# EAGLE design PiRingo_04 (EAGLE 6.5.0)
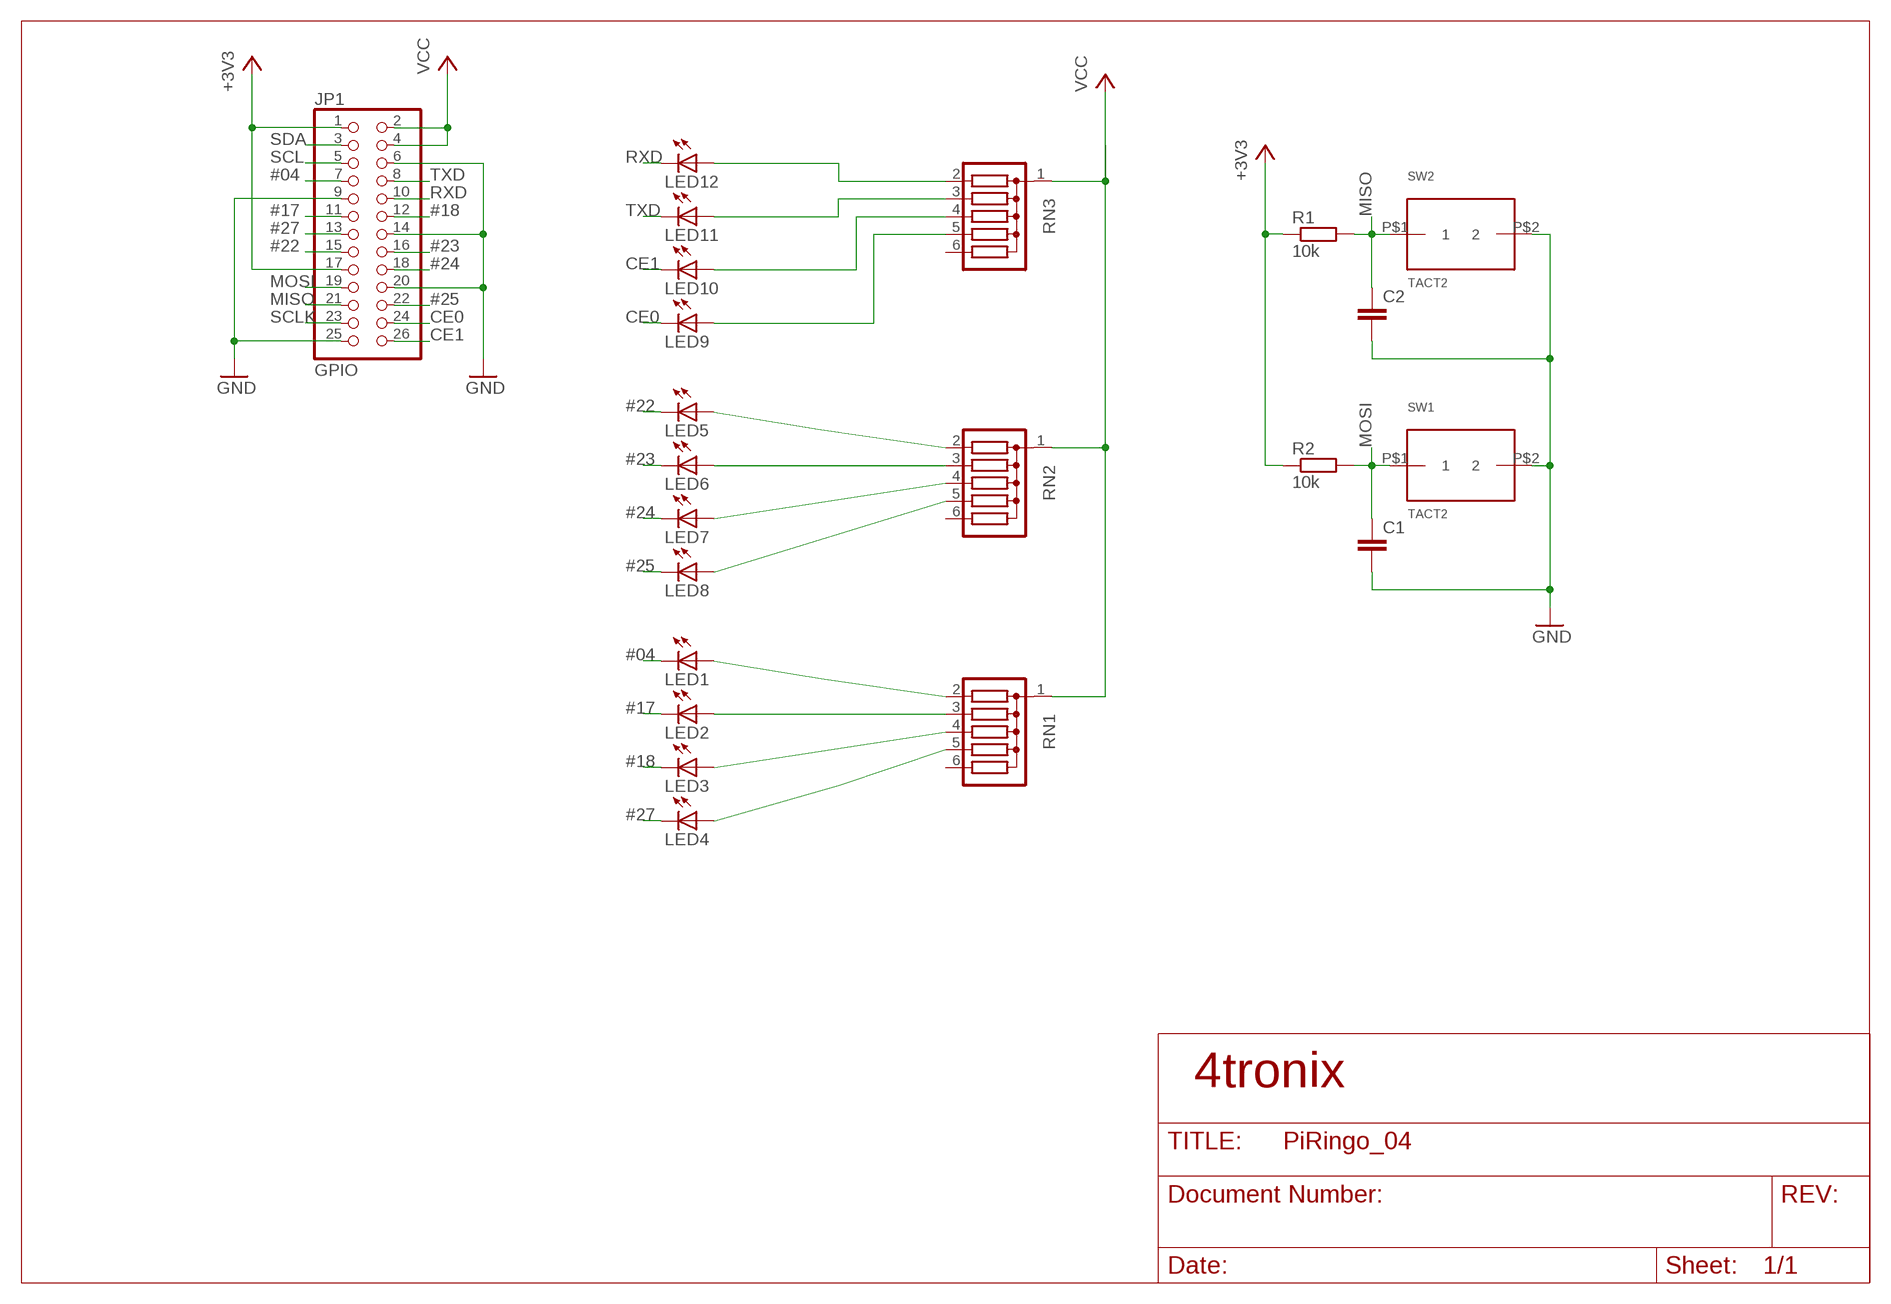
[diagram p0: schematic, sheet 1]

## Parts
C1  C5/2.5  [C5B2.5]
C2  C5/2.5  [C5B2.5]
JP1  GPIO  HEADER-2X13  [2X13]
LED1  LED3MM  [LED3MM]
LED2  LED3MM  [LED3MM]
LED3  LED3MM  [LED3MM]
LED4  LED3MM  [LED3MM]
LED5  LED3MM  [LED3MM]
LED6  LED3MM  [LED3MM]
LED7  LED3MM  [LED3MM]
LED8  LED3MM  [LED3MM]
LED9  LED3MM  [LED3MM]
LED10  LED3MM  [LED3MM]
LED11  LED3MM  [LED3MM]
LED12  LED3MM  [LED3MM]
R1  10k  R-EU_0207/7  [0207/7]
R2  10k  R-EU_0207/7  [0207/7]
RN1  G05R  [SIL6]
RN2  G05R  [SIL6]
RN3  G05R  [SIL6]
SW1  TACT2  [TACT2-PIN]
SW2  TACT2  [TACT2-PIN]

## Nets
#04: JP1.7 LED1.K(C)
#17: JP1.11 LED2.K(C)
#18: JP1.12 LED3.K(C)
#22: JP1.15 LED5.K(C)
#23: JP1.16 LED6.K(C)
#24: JP1.18 LED7.K(C)
#25: JP1.22 LED8.K(C)
#27: JP1.13 LED4.K(C)
+3V3: JP1.1 JP1.17 R1.1 R2.1
CE0: JP1.24 LED9.K(C)
CE1: JP1.26 LED10.K(C)
GND: C1.2 C2.2 JP1.6 JP1.9 JP1.14 JP1.20 JP1.25 SW1.P$2 SW2.P$2
MISO: C2.1 JP1.21 R1.2 SW2.P$1
MOSI: C1.1 JP1.19 R2.2 SW1.P$1
N$1: LED12.A RN3.2
N$2: LED1.A RN1.2
N$3: LED11.A RN3.3
N$4: LED10.A RN3.4
N$6: LED2.A RN1.3
N$7: LED3.A RN1.4
N$8: LED4.A RN1.5
N$9: LED5.A RN2.2
N$10: LED6.A RN2.3
N$11: LED7.A RN2.4
N$12: LED8.A RN2.5
N$13: LED9.A RN3.5
RXD: JP1.10 LED12.K(C)
SCL: JP1.5
SCLK: JP1.23
SDA: JP1.3
TXD: JP1.8 LED11.K(C)
VCC: JP1.2 JP1.4 RN1.1 RN2.1 RN3.1
Unconnected: RN1.6 RN2.6 RN3.6

## Notes on the sheet
- 4tronix

## Library data of the parts
C1 C2 = capacitor-wima:C: CAPACITOR naming: grid - package width
JP1 = microbuilder:HEADER-2X13
LED1-LED12 = adafruit:LED: LED OSRAM: - CHIPLED LG R971, LG N971, LY N971, LG Q971, LY Q971, LO R971, LY R971 LH N974, LH R974 LS Q976, LO Q976, LY Q976 LO Q996 - Hyper CHIPLED LW Q18S LB Q993, LB Q99A, LB R99A - SideLED LS A670, LO A670, LY A670, LG A670, LP A670 LB A673, LV A673, LT A673, LW A673 LH A674 LY A675 LS A676, LA A676, LO A676, LY A676, LW A676 LS A679, LY A679, LG A679 - Hyper Micro SIDELED® LS Y876, LA Y876, LO Y876, LY Y876 LT Y87S - SmartLED LW L88C, LW L88S LB L89C, LB L89S, LG L890 LS L89K, LO L89K, LY L89K LS L896, LA L896, LO L896, LY L896 - TOPLED LS T670, LO T670, LY T670, LG T670, LP T670 LSG T670, LSP T670, LSY T670, LOP T670, LYG T670 LG T671, LOG T671, LSG T671 LB T673, LV T673, LT T673, LW T673 LH T674 LS T676, LA T676, LO T676, LY T676, LB T676, LH T676, LSB T676, LW T676 LB T67C, LV T67C, LT T67C, LS T67K, LO T67K, LY T67K, LW E67C LS E67B, LA E67B, LO E67B, LY E67B, LB E67C, LV E67C, LT E67C LW T67C LS T679, LY T679, LG T679 LS T770, LO T770, LY T770, LG T770, LP T770 LB T773, LV T773, LT T773, LW T773 LH T774 LS E675, LA E675, LY E675, LS T675 LS T776, LA T776, LO T776, LY T776, LB T776 LHGB T686 LT T68C, LB T68C - Hyper Mini TOPLED® LB M676 - Mini TOPLED Santana® LG M470 LS M47K, LO M47K, LY M47K Source: http://www.osram.convergy.de/
R1 R2 = rcl:R-EU_: RESISTOR, European symbol
RN1-RN3 = resistor-sil:G05R: SIL RESISTOR; OC_FARNELL: unknown; OC_NEWARK: unknown
SW1 SW2 = 4tronix:TACT2

## Board
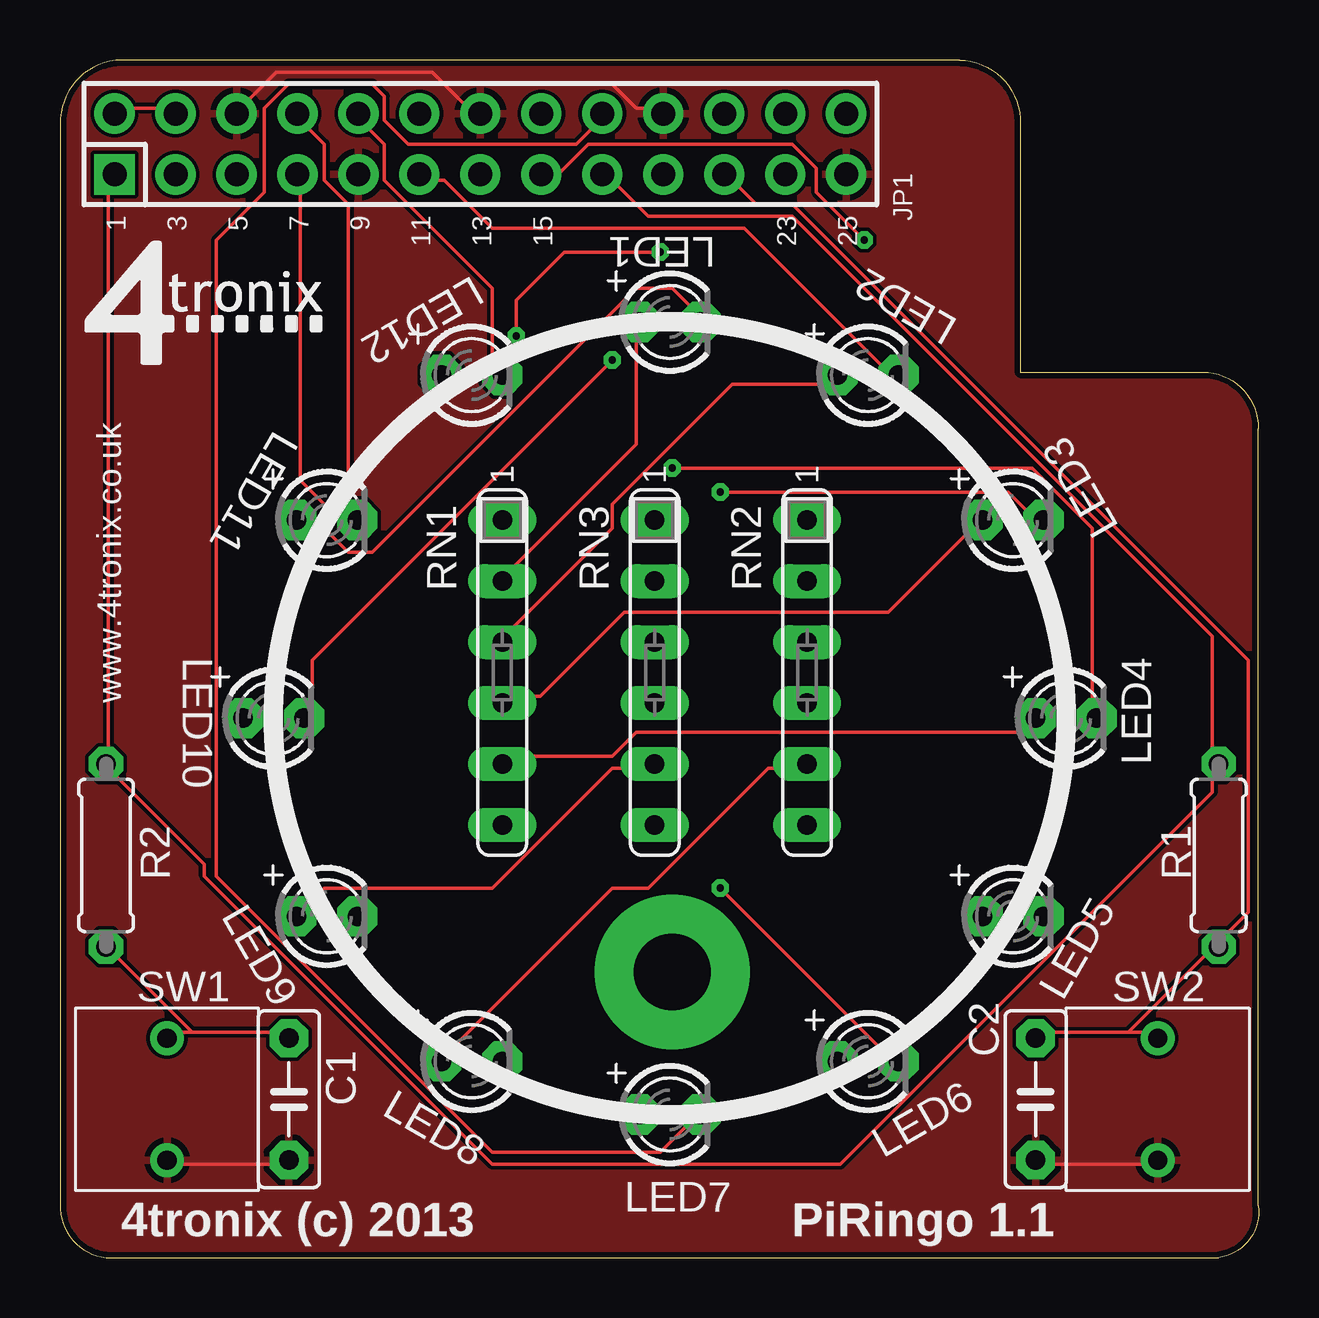
[diagram p1: board, top side]
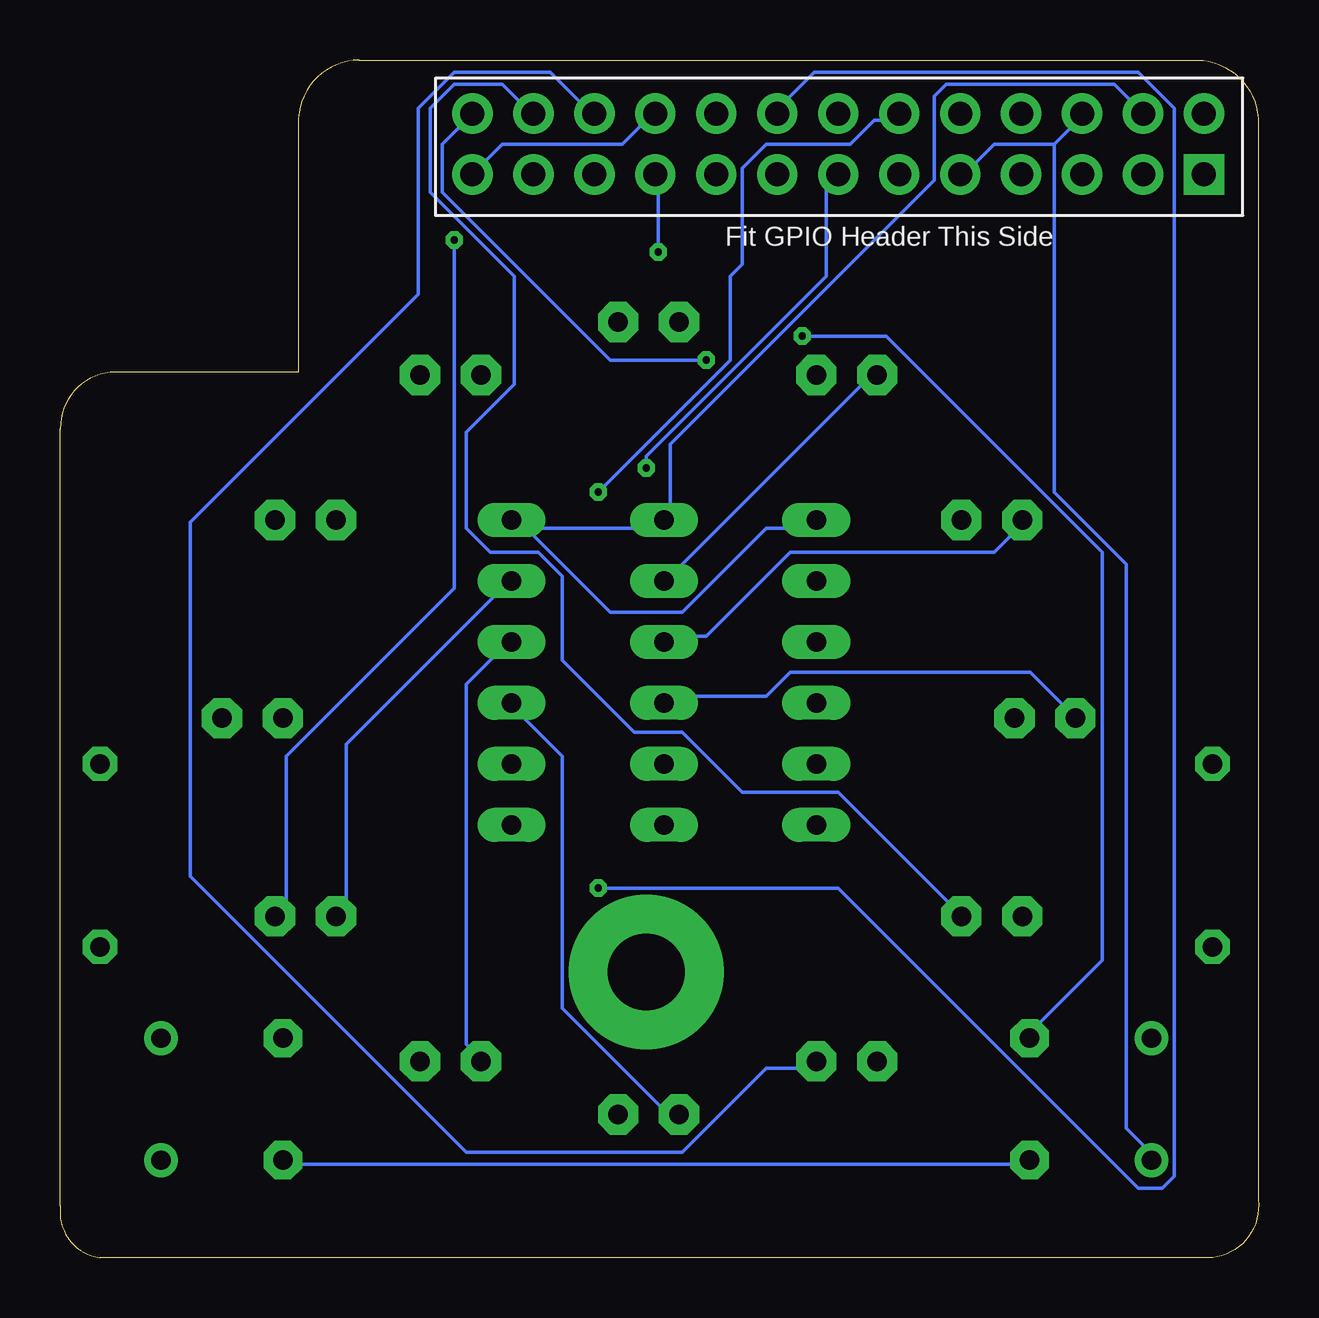
[diagram p2: board, bottom side, seen from below]

Size 49.94 x 49.9 mm. Coordinates in mm from the lower left corner, seen from the top.
Outline: 40.01,47.24 40.01,38.99
Outline: 40.01,47.24 arc90 37.48,49.9 2.55,49.9 arc90 0.01,47.24 0.01,2.41 arc90 1.92,0 48.27,0 arc90 49.93,2.16 49.93,34.54 arc90 47.64,36.9 40.02,36.9 40.02,38.99
Outline: 40.01,47.24 40.02,44.7
Copper layers (1*16): Top 0.035mm / dielectric 1.5mm / Bottom 0.035mm
Design rules "DFRobot_Eagle_Rule_v0.4": minimum track width 6mil, minimum drill 12mil, track to track 6mil, track to pad 6mil, pad to pad 6mil, via to via 6mil, smd to smd 0mil, copper to edge 10mil, drill to drill 10mil, minimum pad ring 12mil, minimum via ring 8mil, stop-mask expansion 2mil, vias tented up to drill 25mil, thermal gap 10mil

### Footprints (pad centres in the part's own frame; a part is rotated, then mirrored left to right if it is on the bottom)
C5B2.5 = drill 0.813 pad 1.6 octagon: 1 -2.54,0; 2 2.54,0
2X13 = drill 1 pad 1.676 square: 1 -15.24,-1.27 | drill 1 pad 1.676: 2 -15.24,1.27; 3 -12.7,-1.27; 4 -12.7,1.27; 5 -10.16,-1.27; 6 -10.16,1.27; 7 -7.62,-1.27; 8 -7.62,1.27; 9 -5.08,-1.27; 10 -5.08,1.27; 11 -2.54,-1.27; 12 -2.54,1.27; 13 0,-1.27; 14 0,1.27; 15 2.54,-1.27; 16 2.54,1.27; 17 5.08,-1.27; 18 5.08,1.27; 19 7.62,-1.27; 20 7.62,1.27; 21 10.16,-1.27; 22 10.16,1.27; 23 12.7,-1.27; 24 12.7,1.27; 25 15.24,-1.27; 26 15.24,1.27
LED3MM = drill 0.813 pad 1.676 octagon: A -1.27,0; K 1.27,0
0207/7 = drill 0.813 octagon: 1 -3.81,0; 2 3.81,0
SIL6 = drill 0.813 long: 1 -6.35,0; 2 -3.81,0; 3 -1.27,0; 4 1.27,0; 5 3.81,0; 6 6.35,0
TACT2-PIN = drill 0.8: P$1 -2.54,0; P$2 2.54,0

### Placement (x,y rotation side)
C1  9.54,6.6 270 top
C2  40.65,6.6 270 top
JP1  17.51,46.4 0 top
LED1  25.41,38.99 0 top
LED2  33.67,36.78 0 top
LED3  39.71,30.73 0 top
LED4  41.92,22.48 0 top
LED5  39.71,14.22 0 top
LED6  33.67,8.18 0 top
LED7  25.41,5.97 0 top
LED8  17.16,8.18 0 top
LED9  11.12,14.22 0 top
LED10  8.9,22.48 0 top
LED11  11.12,30.73 0 top
LED12  17.16,36.78 0 top
R1  48.27,16.76 270 top
R2  1.92,16.76 270 top
RN1  18.43,24.38 270 top
RN2  31.13,24.38 270 top
RN3  24.78,24.38 270 top
SW1  4.46,6.6 270 top
SW2  45.73,6.6 270 top

### Tracks (layer width: path | path; a pad name or v marks a point on that pad's centre or on a via)
#04
  Top 0.152: JP1.7 10.01,44.9 10.01,32.4 11.01,31.4 11.01,30.4 12.01,29.4 13.01,29.4 24.01,40.4 25.51,40.4 26.51,39.4 LED1.K
#17
  Top 0.152: JP1.11 15.01,44.9 16.01,44.9 18.01,42.9 28.51,42.9 34.51,36.9 LED2.K
#18  (via drill 0.3)
  Top 0.152: v27.51,31.9 39.51,31.9 40.51,30.9 LED3.K
  Bottom 0.152: v27.51,31.9 22.01,37.4 22.01,40.9 21.51,41.4 21.51,45.4 20.51,46.4 17.01,46.4 16.01,47.4 15.01,47.4 JP1.12
#22  (via drill 0.3)
  Top 0.152: v33.51,42.4 31.51,44.4 31.51,45.4 30.51,46.4 22.01,46.4 20.51,44.9 JP1.15
  Bottom 0.152: v33.51,42.4 33.51,27.9 40.51,20.9 40.51,14.4 LED5.K
#23  (via drill 0.3)
  Top 0.152: v27.51,15.4 34.51,8.4 LED6.K
  Bottom 0.152: v27.51,15.4 17.51,15.4 5.01,2.9 4.01,2.9 3.51,3.4 3.51,47.9 5.01,49.4 18.51,49.4 20.01,47.9 JP1.16
#24
  Top 0.152: LED7.K 26.51,5.9 25.01,4.4 18.01,4.4 6.51,15.9 6.51,42.4 8.51,44.4 8.51,47.9 9.51,48.9 13.01,48.9 13.51,48.4 13.51,47.4 14.51,46.4 21.51,46.4 22.51,47.4 JP1.18
#25
  Bottom 0.152: LED8.K 18.51,7.9 20.51,7.9 24.01,4.4 33.01,4.4 44.51,15.9 44.51,30.63 35.01,40.13 35.01,47.9 33.51,49.4 29.51,49.4 28.01,47.9 JP1.22
#27  (via drill 0.3)
  Top 0.152: v25.51,32.9 40.51,32.9 43.01,30.4 43.01,22.9 LED4.K
  Bottom 0.152: v25.51,32.9 25.51,33.4 18.01,40.9 18.01,44.9 JP1.13
+3V3
  Top 0.152: JP1.1 2.01,44.9 2.01,20.9 R2.1 2.01,20.4 6.01,16.4 6.01,15.9 18.01,3.9 32.51,3.9 48.01,19.4 48.01,20.4 R1.1 48.01,20.9 48.01,25.9 30.51,43.4 24.51,43.4 23.01,44.9 JP1.17
CE0
  Bottom 0.152: LED9.K 12.51,14.4 17.51,19.4 21.51,19.4 24.01,21.9 26.01,21.9 29.01,24.9 29.01,28.4 30.01,29.4 32.01,29.4 33.01,30.4 33.01,34.4 31.01,36.4 31.01,40.9 34.51,44.4 34.51,47.9 33.51,48.9 31.51,48.9 30.51,47.9 JP1.24
CE1  (via drill 0.3)
  Top 0.152: v23.01,37.4 10.51,24.9 10.51,22.9 LED10.K
  Bottom 0.152: v23.01,37.4 27.01,37.4 34.01,44.4 34.01,46.4 33.01,47.4 JP1.26
GND
  Top 0.152: 16.01,48.9 17.01,47.9 JP1.14 | 16.01,48.9 15.51,49.4 9.01,49.4 7.51,47.9 JP1.6 | 16.01,48.9 23.01,48.9 24.01,47.9 25.01,47.9 JP1.20 | SW1.P$2 4.51,3.9 9.51,3.9 C1.2 | SW2.P$2 45.51,3.9 41.01,3.9 C2.2
  Bottom 0.152: JP1.20 25.51,47.4 26.51,46.4 31.51,46.4 32.51,45.4 JP1.25 | 8.51,46.4 11.01,46.4 12.01,45.4 JP1.9 | 8.51,46.4 7.51,47.4 JP1.6 | C1.2 10.01,3.9 40.51,3.9 C2.2 | 8.51,46.4 8.51,31.9 5.51,28.9 5.51,5.4 4.51,4.4 SW1.P$2
  pour Top: -0.62,50.42 51.45,50.42 51.45,-0.38 -1.89,-0.38
MISO
  Top 0.152: 44.51,9.4 41.01,9.4 C2.1 | 44.51,9.4 45.51,9.4 SW2.P$1 | 44.51,9.4 48.01,12.9 R1.2 48.51,13.4 49.51,14.4 49.51,24.9 30.51,43.9 29.01,43.9 28.01,44.9 JP1.21
MOSI  (via drill 0.3)
  Top 0.152: 5.51,9.4 9.51,9.4 C1.1 | 5.51,9.4 4.51,9.4 SW1.P$1 | 5.51,9.4 2.01,12.9 R2.2 | v25.01,41.9 21.01,41.9 19.01,39.9 v19.01,38.4
  Bottom 0.152: v25.01,41.9 25.01,44.9 JP1.19 | v19.01,38.4 15.51,38.4 6.51,29.4 6.51,12.4 9.51,9.4 C1.1
N$1
  Bottom 0.152: RN3.2 24.51,28.4 16.01,36.9 LED12.A
N$2
  Top 0.152: RN1.2 18.51,28.4 24.01,33.9 24.01,38.9 LED1.A
N$3
  Bottom 0.152: RN3.3 24.51,25.9 23.01,25.9 19.51,29.4 11.01,29.4 10.01,30.4 LED11.A
N$4
  Bottom 0.152: RN3.4 24.51,23.4 20.51,23.4 19.51,24.4 9.51,24.4 8.01,22.9 LED10.A
N$5  (via drill 3.2 pad 6.45)
  other vias: 25.51,11.9
N$6
  Top 0.152: RN1.3 18.51,25.9 23.01,30.4 23.01,31.4 28.01,36.4 32.01,36.4 LED2.A
N$7
  Top 0.152: RN1.4 18.51,23.4 20.01,23.4 23.51,26.9 34.51,26.9 38.01,30.4 LED3.A
N$8
  Top 0.152: RN1.5 18.51,20.9 23.01,20.9 24.01,21.9 40.01,21.9 40.51,22.4 LED4.A
N$9
  Bottom 0.152: RN2.2 31.51,27.9 38.01,21.4 38.01,14.4 LED5.A
N$10
  Bottom 0.152: RN2.3 31.51,25.4 33.01,23.9 33.01,8.9 32.51,8.4 LED6.A
N$11
  Bottom 0.152: RN2.4 31.01,22.9 29.01,20.9 29.01,10.4 24.51,5.9 LED7.A
N$12
  Top 0.152: RN2.5 31.01,20.4 29.51,20.4 24.51,15.4 23.01,15.4 16.01,8.4 LED8.A
N$13
  Top 0.152: RN3.5 24.51,20.4 23.01,20.4 18.01,15.4 11.01,15.4 10.01,14.4 LED9.A
RXD
  Top 0.152: LED12.K 18.01,36.9 18.01,40.4 13.51,44.9 13.51,46.4 12.51,47.4 JP1.10
TXD
  Top 0.152: LED11.K 12.01,30.9 12.01,43.9 11.01,44.9 11.01,46.4 10.01,47.4 JP1.8
VCC
  Top 0.152: JP1.2 2.51,47.9 4.51,47.9 JP1.4
  Bottom 0.152: JP1.4 5.01,47.9 6.01,48.9 13.01,48.9 13.51,48.4 13.51,44.9 24.51,33.9 24.51,30.9 RN3.1 25.01,30.4 30.51,30.4 | 30.51,30.4 31.01,30.9 RN2.1 30.51,30.4 | 30.51,30.4 27.01,26.9 24.01,26.9 20.51,30.4 18.51,30.4 RN1.1

### Text on the board
tPlace: 1 | 3 | 5 | 7 | 9 | 11 | 13 | 15 | 23 | 25 | www.4tronix.co.uk | SW1 | SW2 | 4tronix (c) 2013 | PiRingo 1.1
bPlace: Fit GPIO Header This Side